# Altium schematic sheet main.SchDoc
size A; SheetNumber: 1; SheetTotal: 1
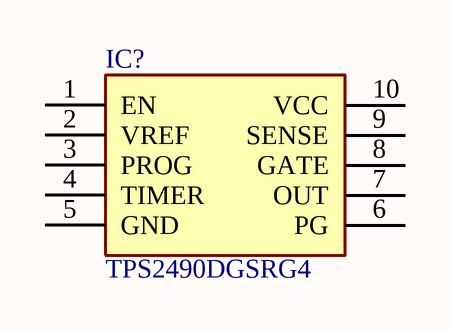
[diagram p0: main.SchDoc]

## Parts
IC?  TPS2490DGSRG4  [SOP50P490X110-10N]

## Nets

Not connected (* = marked no-connect by the designer): IC? 1(EN) 2(VREF) 3(PROG) 4(TIMER) 5(GND) 6(PG) 7(OUT) 8(GATE) 9(SENSE) 10(VCC)

## Library data of the parts
IC? = TPS2490DGSRG4: Integrated Circuit; Manufacturer_Name: Texas Instruments; Datasheet Link: https://www.ti.com/lit/gpn/tps2490; Height: 1.1mm; Manufacturer_Part_Number: TPS2490DGSRG4; Mouser Part Number: 595-TPS2490DGSRG4; Mouser Price/Stock: https://www.mouser.co.uk/ProductDetail/Texas-Instruments/TPS2490DGSRG4?qs=zwk82MlA57auQClRqTFrLQ%3D%3D; Arrow Part Number: TPS2490DGSRG4; Arrow Price/Stock: https://www.arrow.com/en/products/tps2490dgsrg4/texas-instruments